# Altium project Battman.PrjPcb
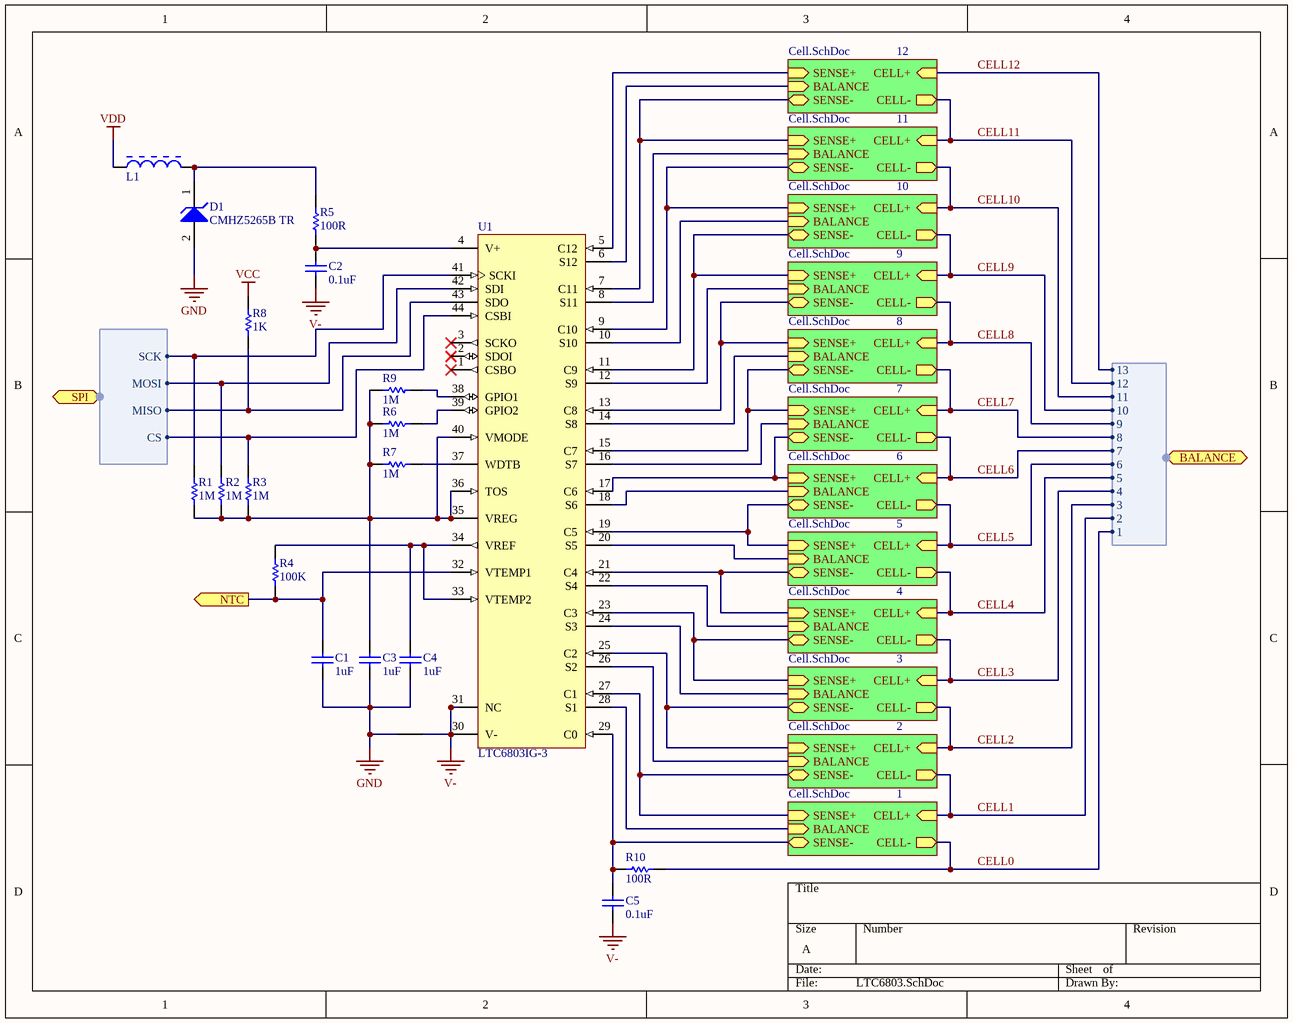
[diagram p0: LTC6803.SchDoc]
6 sheets, 131 parts. Net scope: hierarchical (ports join the sheet entries above them; power ports are global).
Board file: BMS.PcbDoc
Sheets:
  LTC6803.SchDoc
  MCU.SchDoc
  Charging.SchDoc
  3V3.SchDoc
  Switches.SchDoc
  Buzzer.SchDoc

## Sheet LTC6803.SchDoc
size A; SheetNumber: 4

### Parts
*  NetTie  [NetTie]  (value not drawn)  (net tie, no BOM)
C1  value 1uF  [C0402[1005X55]]  (hidden comment: 1uF 6.3V 0402)
C2  value 0.1uF  [C0402[1005X55]]  (hidden comment: 0.1uF 100V 0402)
C3  value 1uF  [C0402[1005X55]]  (hidden comment: 1uF 6.3V 0402)
C4  value 1uF  [C0402[1005X55]]  (hidden comment: 1uF 6.3V 0402)
C5  value 0.1uF  [C0402[1005X55]]  (hidden comment: 0.1uF 6.3V 0402)
D1  CMHZ5265B TR  [SOD-123]
L1  MURA-FB-2  [MURA-BLM31-B60-CHIP-2_V3]  (value not drawn)
R1  value 1M  [R0402[1005]]  (hidden comment: 1M 1% 0402)
R2  value 1M  [R0402[1005]]  (hidden comment: 1M 1% 0402)
R3  value 1M  [R0402[1005]]  (hidden comment: 1M 1% 0402)
R4  value 100K  [R0402[1005]]  (hidden comment: 100K 1% 0402)
R5  value 100R  [R0402[1005]]  (hidden comment: 100R 1% 0402)
R6  value 1M  [R0402[1005]]  (hidden comment: 1M 1% 0402)
R7  value 1M  [R0402[1005]]  (hidden comment: 1M 1% 0402)
R8  value 1K  [R0402[1005]]  (hidden comment: 1K 1% 0402)
R9  value 1M  [R0402[1005]]  (hidden comment: 1M 1% 0402)
R10  value 100R  [R0402[1005]]  (hidden comment: 100R 1% 0402)
U1  LTC6803IG-3  [TSSOP-44]

### Sub-sheets
1 = Cell.SchDoc (file not in this document): SENSE+, SENSE- (bidir), BALANCE (in), CELL+ (in), CELL- (out)
2 = Cell.SchDoc (file not in this document): SENSE+, SENSE- (bidir), BALANCE (in), CELL+ (in), CELL- (out)
3 = Cell.SchDoc (file not in this document): SENSE+, SENSE- (bidir), BALANCE (in), CELL+ (in), CELL- (out)
4 = Cell.SchDoc (file not in this document): SENSE+, SENSE- (bidir), BALANCE (in), CELL+ (in), CELL- (out)
5 = Cell.SchDoc (file not in this document): SENSE+, SENSE- (bidir), BALANCE (in), CELL+ (in), CELL- (out)
6 = Cell.SchDoc (file not in this document): SENSE+, SENSE- (bidir), BALANCE (in), CELL+ (in), CELL- (out)
7 = Cell.SchDoc (file not in this document): SENSE+, SENSE- (bidir), BALANCE (in), CELL+ (in), CELL- (out)
8 = Cell.SchDoc (file not in this document): SENSE+, SENSE- (bidir), BALANCE (in), CELL+ (in), CELL- (out)
9 = Cell.SchDoc (file not in this document): SENSE+, SENSE- (bidir), BALANCE (in), CELL+ (in), CELL- (out)
10 = Cell.SchDoc (file not in this document): SENSE+, SENSE- (bidir), BALANCE (in), CELL+ (in), CELL- (out)
11 = Cell.SchDoc (file not in this document): SENSE+, SENSE- (bidir), BALANCE (in), CELL+ (in), CELL- (out)
12 = Cell.SchDoc (file not in this document): SENSE+, SENSE- (bidir), BALANCE (in), CELL+ (in), CELL- (out)

### Ports
BALANCE (harness Balance), NTC (out), SPI (harness SPI)

### Harnesses
SPI: SCK, MOSI, MISO, CS
Balance: 13, 12, 11, 10, 9, 8, 6, 7, 5, 3, 4, 2, 1

### Nets
GND: *.1 C1.1 C3.1 C4.1 D1.2(A)
V-: *.2 C2.1 C5.1 U1.30(V-) U1.31(NC)
VCC: R8.2
VDD: L1.1
CELL0: R10.2 ; sheet 1/CELL-, port BALANCE.1
CELL1: sheet 2/CELL-, sheet 1/CELL+, port BALANCE.2
CELL2: sheet 3/CELL-, sheet 2/CELL+, port BALANCE.3
CELL3: sheet 4/CELL-, sheet 3/CELL+, port BALANCE.4
CELL4: sheet 5/CELL-, sheet 4/CELL+, port BALANCE.5
CELL5: sheet 6/CELL-, sheet 5/CELL+, port BALANCE.6
CELL6: sheet 7/CELL-, sheet 6/CELL+, port BALANCE.7
CELL7: sheet 8/CELL-, sheet 7/CELL+, port BALANCE.8
CELL8: sheet 9/CELL-, sheet 8/CELL+, port BALANCE.9
CELL9: sheet 10/CELL-, sheet 9/CELL+, port BALANCE.10
CELL10: sheet 11/CELL-, sheet 10/CELL+, port BALANCE.11
CELL11: sheet 12/CELL-, sheet 11/CELL+, port BALANCE.12
CELL12: sheet 12/CELL+, port BALANCE.13
NetC1_2: C1.2 R4.1 U1.32(VTEMP1) ; port NTC
NetC2_2: C2.2 R5.1 U1.4(V+)
NetC3_2: C3.2 R1.1 R2.1 R3.1 R6.2 R7.2 R9.2 U1.35(VREG) U1.36(TOS) U1.40(VMODE)
NetC4_2: C4.2 R4.2 U1.33(VTEMP2) U1.34(VREF)
NetC5_2: C5.2 R10.1 U1.29(C0) ; sheet 1/SENSE-
NetD1_1: D1.1(K) L1.2 R5.2
NetR1_2: R1.2 U1.41(SCKI) ; port SPI.SCK
NetR2_2: R2.2 U1.42(SDI) ; port SPI.MOSI
NetR3_2: R3.2 U1.44(CSBI) ; port SPI.CS
NetR6_1: R6.1 U1.39(GPIO2)
NetR7_1: R7.1 U1.37(WDTB)
NetR8_1: R8.1 U1.43(SDO) ; port SPI.MISO
NetR9_1: R9.1 U1.38(GPIO1)
NetU1_5: U1.5(C12) ; sheet 12/SENSE+
NetU1_6: U1.6(S12) ; sheet 12/BALANCE
NetU1_7: U1.7(C11) ; sheet 12/SENSE-, sheet 11/SENSE+
NetU1_8: U1.8(S11) ; sheet 11/BALANCE
NetU1_9: U1.9(C10) ; sheet 11/SENSE-, sheet 10/SENSE+
NetU1_10: U1.10(S10) ; sheet 10/BALANCE
NetU1_11: U1.11(C9) ; sheet 10/SENSE-, sheet 9/SENSE+
NetU1_12: U1.12(S9) ; sheet 9/BALANCE
NetU1_13: U1.13(C8) ; sheet 9/SENSE-, sheet 8/SENSE+
NetU1_14: U1.14(S8) ; sheet 8/BALANCE
NetU1_15: U1.15(C7) ; sheet 8/SENSE-, sheet 7/SENSE+
NetU1_16: U1.16(S7) ; sheet 7/BALANCE
NetU1_17: U1.17(C6) ; sheet 7/SENSE-, sheet 6/SENSE+
NetU1_18: U1.18(S6) ; sheet 6/BALANCE
NetU1_19: U1.19(C5) ; sheet 6/SENSE-, sheet 5/SENSE+
NetU1_20: U1.20(S5) ; sheet 5/BALANCE
NetU1_21: U1.21(C4) ; sheet 5/SENSE-, sheet 4/SENSE+
NetU1_22: U1.22(S4) ; sheet 4/BALANCE
NetU1_23: U1.23(C3) ; sheet 4/SENSE-, sheet 3/SENSE+
NetU1_24: U1.24(S3) ; sheet 3/BALANCE
NetU1_25: U1.25(C2) ; sheet 3/SENSE-, sheet 2/SENSE+
NetU1_26: U1.26(S2) ; sheet 2/BALANCE
NetU1_27: U1.27(C1) ; sheet 2/SENSE-, sheet 1/SENSE+
NetU1_28: U1.28(S1) ; sheet 1/BALANCE

Not connected (* = marked no-connect by the designer): U1 1(CSBO)* 2(SDOI)* 3(SCKO)*

### Library data of the parts
C1 C3 C4 = CAP_1uF_6.3V_0402_10%: 1uF 6.3V 10% 0402 (1005 Metric); PartNumber: GRM155R70J105KA12D; Manufacturer: Murata; Tolerance: 10%; Mounting Technology: Surface Mount; PackageReference: 0402; PackageDescription: 0402 (1005 Metric); Voltage: 6.3V
C2 = CAP_0.1uF_100V_0402_10%: 0.1uF 100V 10% 0402 (1005 Metric); PartNumber: GRM155R62A104KE14D; Manufacturer: Murata; Tolerance: 10%; Mounting Technology: Surface Mount; PackageReference: 0402; PackageDescription: 0402 (1005 Metric); Voltage: 100V
C5 = CAP_0.1uF_6.3V_0402_10%: 0.1uF 6.3V 10% 0402 (1005 Metric); PartNumber: GRM155R70J104KA01D; Manufacturer: Murata; Tolerance: 10%; Mounting Technology: Surface Mount; PackageReference: 0402; PackageDescription: 0402 (1005 Metric); Voltage: 6.3V
D1 = CMHZ5265B: Zener Diodes 500mW Zener Diode 185mA 58.9V to 2V; Manufacturer: Central Semiconductor; PartNumber: CMHZ5265B TR; Mounting Technology: Surface Mount; PackageReference: SOD-123; PackageDescription: SOD, 2-Leads, Body 2.69x1.6mm
L1 = MURA-FB-2: EMI Filter Beads, Chips & Arrays 1206 33 OHM; PartNumber: BLM31PG330SN1L; Manufacturer: Murata; Mounting Technology: Surface Mount; PackageReference: 1206; PackageDescription: 1206 (3216 Metric)
R1-R3 R6 R7 R9 = RES_1M_0402_1%: 1M 0.063W 1% 0402 (1005 Metric); Manufacturer: KOA Speer; PartNumber: RK73H1ETTP1004F; Power: 0.063W; Tolerance: 1%; Mounting Technology: Surface Mount; PackageReference: 0402; PackageDescription: 0402 (1005 Metric); ComponentLink1Description: Datasheet; ComponentLink1URL: http://www.koaspeer.com/catimages/Products/RK73H/RK73H.pdf
R4 = RES_100K_0402_1%: 100K 0.063W 1% 0402 (1005 Metric); Manufacturer: KOA Speer; PartNumber: RK73H1ETTP1003F; Power: 0.063W; Tolerance: 1%; Mounting Technology: Surface Mount; PackageReference: 0402; PackageDescription: 0402 (1005 Metric); ComponentLink1Description: Datasheet; ComponentLink1URL: http://www.koaspeer.com/catimages/Products/RK73H/RK73H.pdf
R5 R10 = RES_100R_0402_1%: 100R 0.063W 1% 0402 (1005 Metric); Manufacturer: KOA Speer; PartNumber: RK73H1ETTP1000F; Power: 0.063W; Tolerance: 1%; Mounting Technology: Surface Mount; PackageReference: 0402; PackageDescription: 0402 (1005 Metric); ComponentLink1Description: Datasheet; ComponentLink1URL: http://www.koaspeer.com/catimages/Products/RK73H/RK73H.pdf
R8 = RES_1K_0402_1%: 1K 0.063W 1% 0402 (1005 Metric); Manufacturer: KOA Speer; PartNumber: RK73H1ETTP1001F; Tolerance: 1%; Power: 0.063W; Mounting Technology: Surface Mount; PackageReference: 0402; PackageDescription: 0402 (1005 Metric); ComponentLink1Description: Datasheet; ComponentLink1URL: http://www.koaspeer.com/catimages/Products/RK73H/RK73H.pdf
U1 = LTC6803IG-3: PartNumber: LTC6803IG-3#PBF; Manufacturer: Linear Technology; PackageReference: TSSOP-44; Mounting Technology: Surface Mount; PackageDescription: SOP, 44-Leads, Body 13.1x5.6mm, Pitch 0.5mm

## Sheet MCU.SchDoc
size A; SheetNumber: 3
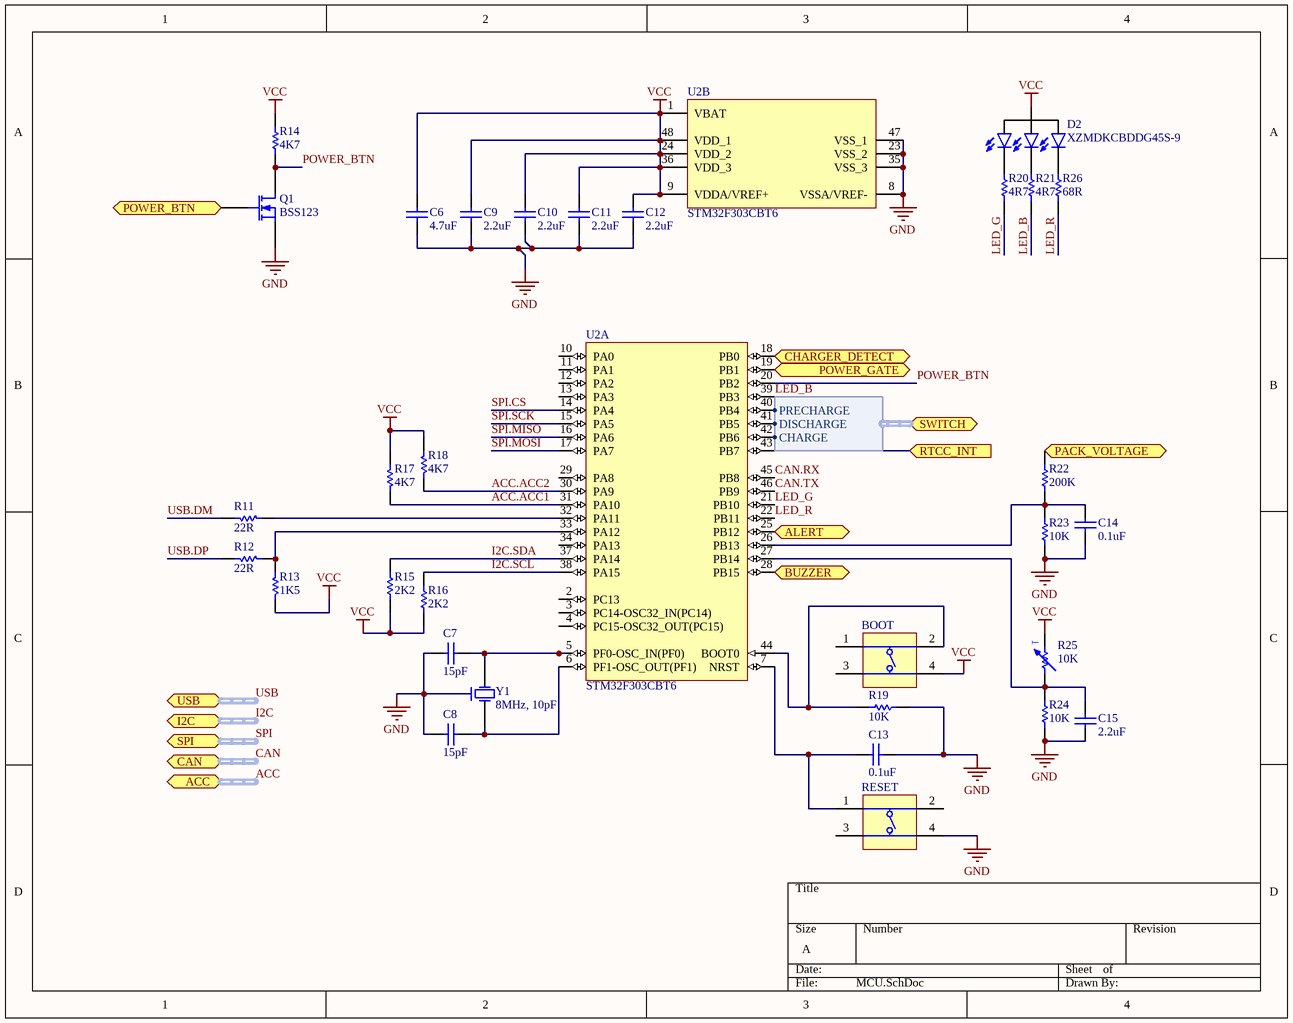
[diagram p1: MCU.SchDoc]

### Parts
BOOT  (no value)  [SWITCH]
C6  value 4.7uF  [C0402[1005X55]]  (hidden comment: 4.7uF 6.3V 0402)
C7  value 15pF  [C0402[1005X55]]  (hidden comment: 15pF 50V 0402)
C8  value 15pF  [C0402[1005X55]]  (hidden comment: 15pF 50V 0402)
C9  value 2.2uF  [C0402[1005X55]]  (hidden comment: 2.2uF 6.3V 0402)
C10  value 2.2uF  [C0402[1005X55]]  (hidden comment: 2.2uF 6.3V 0402)
C11  value 2.2uF  [C0402[1005X55]]  (hidden comment: 2.2uF 6.3V 0402)
C12  value 2.2uF  [C0402[1005X55]]  (hidden comment: 2.2uF 6.3V 0402)
C13  value 0.1uF  [C0402[1005X55]]  (hidden comment: 0.1uF 6.3V 0402)
C14  value 0.1uF  [C0402[1005X55]]  (hidden comment: 0.1uF 6.3V 0402)
C15  value 2.2uF  [C0402[1005X55]]  (hidden comment: 2.2uF 6.3V 0402)
D2  XZMDKCBDDG45S-9  [XZMDKCBDDG45S-9]
Q1  BSS123  [SOT323-3]
R11  value 22R  [R0402[1005]]  (hidden comment: 22R 1% 0402)
R12  value 22R  [R0402[1005]]  (hidden comment: 22R 1% 0402)
R13  value 1K5  [R0402[1005]]  (hidden comment: 1K5 1% 0402)
R14  value 4K7  [R0402[1005]]  (hidden comment: 4K7 1% 0402)
R15  value 2K2  [R0402[1005]]  (hidden comment: 2K2 1% 0402)
R16  value 2K2  [R0402[1005]]  (hidden comment: 2K2 1% 0402)
R17  value 4K7  [R0402[1005]]  (hidden comment: 4K7 1% 0402)
R18  value 4K7  [R0402[1005]]  (hidden comment: 4K7 1% 0402)
R19  value 10K  [R0402[1005]]  (hidden comment: 10K 1% 0402)
R20  value 4R7  [R0402[1005]]  (hidden comment: 4R7 1% 0402)
R21  value 4R7  [R0402[1005]]  (hidden comment: 4R7 1% 0402)
R22  value 200K  [R0402[1005]]  (hidden comment: 200K 1% 0402)
R23  value 10K  [R0402[1005]]  (hidden comment: 10K 1% 0402)
R24  value 10K  [R0402[1005]]  (hidden comment: 10K 1% 0402)
R25  value 10K  [R0402[1005]]  (hidden comment: 10K 0.5% 0402)
R26  value 68R  [R0402[1005]]  (hidden comment: 68R 1% 0402)
RESET  (no value)  [SWITCH]
U2  STM32F303CBT6  [LQFP-48]  (parts A,B of 2)
Y1  8MHz, 10pF  [ABRA-ABM3B-4_V]

### Ports
ACC (harness Accessory Outputs), ALERT (in), BUZZER (out), CAN (harness CAN Input), CHARGER_DETECT (in), I2C (harness I2C), PACK_VOLTAGE (in), POWER_BTN (in), POWER_GATE (out), RTCC_INT (in), SPI (harness SPI), SWITCH (harness Switches), USB (harness USB)

### Harnesses
Switches: CHARGE, DISCHARGE, PRECHARGE

### Nets
GND: C6.1 C7.1 C8.1 C9.1 C10.1 C11.1 C12.1 C13.2 C14.1 C15.1 Q1.2(S) R19.2 R23.1 R24.1 RESET.4(T3) U2.8(VSSA/VREF-) U2.23(VSS_2) U2.35(VSS_3) U2.47(VSS_1) Y1.2
VCC: BOOT.4(T3) C6.2 C9.2 C10.2 C11.2 C12.2 D2.2(A) R13.1 R14.2 R15.2 R16.2 R17.2 R18.2 R25.2 U2.1(VBAT) U2.9(VDDA/VREF+) U2.24(VDD_2) U2.36(VDD_3) U2.48(VDD_1)
ACC.ACC1: R17.1 U2.31(PA10)
ACC.ACC2: R18.1 U2.30(PA9)
CAN.RX: U2.45(PB8)
CAN.TX: U2.46(PB9)
I2C.SCL: R16.1 U2.38(PA15)
I2C.SDA: R15.1 U2.37(PA14)
LED_B: R21.1 U2.39(PB3)
LED_G: R20.1 U2.21(PB10)
LED_R: R26.1 U2.22(PB11)
POWER_BTN: Q1.3(D) R14.1 U2.20(PB2)
SPI.CS: U2.14(PA4)
SPI.MISO: U2.16(PA6)
SPI.MOSI: U2.17(PA7)
SPI.SCK: U2.15(PA5)
USB.DM: R11.2
USB.DP: R12.2
NetBOOT_2: BOOT.2(T2) R19.1 U2.44(BOOT0)
NetC7_2: C7.2 U2.5(PF0-OSC_IN(PF0)) Y1.1(X1)
NetC8_2: C8.2 U2.6(PF1-OSC_OUT(PF1)) Y1.3(X2)
NetC13_1: C13.1 RESET.1(T1) U2.7(NRST)
NetC14_2: C14.2 R22.2 R23.2 U2.26(PB13)
NetC15_2: C15.2 R24.2 R25.1 U2.27(PB14)
NetD2_1: D2.1(K_Red) R26.2
NetD2_3: D2.3(K_Blue) R21.2
NetD2_4: D2.4(K_Green) R20.2
NetQ1_1: Q1.1(G) ; port POWER_BTN
NetR11_1: R11.1 U2.32(PA11)
NetR12_1: R12.1 R13.2 U2.33(PA12)
NetR22_1: R22.1 ; port PACK_VOLTAGE
NetU2_18: U2.18(PB0) ; port CHARGER_DETECT
NetU2_19: U2.19(PB1) ; port POWER_GATE
NetU2_25: U2.25(PB12) ; port ALERT
NetU2_28: U2.28(PB15) ; port BUZZER
NetU2_40: U2.40(PB4) ; port SWITCH.PRECHARGE
NetU2_41: U2.41(PB5) ; port SWITCH.DISCHARGE
NetU2_42: U2.42(PB6) ; port SWITCH.CHARGE
NetU2_43: U2.43(PB7) ; port RTCC_INT

Not connected (* = marked no-connect by the designer): BOOT 1(T1) 3(T3); RESET 2(T2) 3(T3); U2 2(PC13) 3(PC14-OSC32_IN(PC14)) 4(PC15-OSC32_OUT(PC15)) 10(PA0) 11(PA1) 12(PA2) 13(PA3) 29(PA8) 34(PA13)

### Buses and harness runs
harness ACC = port ACC
harness CAN = port CAN
harness I2C = port I2C
harness SPI = port SPI
harness USB = port USB

### Notes on the sheet
- (in symbol NTC_10K_0402_0.5%) T

### Library data of the parts
BOOT RESET = DIPT-DTSM-6: Switch, SPNO Push Button SMD; Manufacturer: C&K Components; PartNumber: PTS810 SJM 250 SMTR LFS; Packing Type: Tape&Reel; Mechanical Life: 200,000 cycles; ComponentLink2URL: http://www.dip.com.tw/Products_tact.htm; ComponentLink1URL: http://www.dip.com.tw/; ComponentLink3URL: http://www.dip.com.tw/PDF/pro_tact/DTSM_G_-6_2_-V.pdf; PackageDescription: Switch, Surface Mount, 4 Leads, Body 4.6x2.8mm, Height 1.9mm; ComponentLink2Description: Datasheet; ComponentLink3Description: Package Specification; ComponentLink1Description: Manufacturer URL; PackageReference: PTS810; Mounting Technology: Surface Mount
C6 = CAP_4.7uF_6.3V_0402_20%: 4.7uF 6.3V 20% 0402 (1005 Metric); PartNumber: GRM155R60J475ME47D; Manufacturer: Murata; Tolerance: 20%; Mounting Technology: Surface Mount; PackageReference: 0402; PackageDescription: 0402 (1005 Metric); Voltage: 6.3V
C7 C8 = CAP_15pF_50V_0402_5%: 15pF 50V 5% 0402 (1005 Metric); PartNumber: GRM1555C1H150JA01D; Manufacturer: Murata; Tolerance: 5%; Mounting Technology: Surface Mount; PackageReference: 0402; PackageDescription: 0402 (1005 Metric); Voltage: 50V
C9-C12 C15 = CAP_2.2uF_6.3V_0402_20%: 2.2uF 6.3V 20% 0402 (1005 Metric); PartNumber: GRM155R60J225ME15D; Manufacturer: Murata; Tolerance: 20%; Mounting Technology: Surface Mount; PackageReference: 0402; PackageDescription: 0402 (1005 Metric); Voltage: 6.3V
C13 C14 = CAP_0.1uF_6.3V_0402_10%: as C5 on sheet LTC6803; Tolerance: 10%; Mounting Technology: Surface Mount; PackageReference: 0402; PackageDescription: 0402 (1005 Metric); Voltage: 6.3V
D2 = XZMDKCBDDG45S-9: Manufacturer: SunLED; PartNumber: XZMDKCBDDG45S-9; PackageReference: 4-PLCC; Mounting Technology: Surface Mount; PackageDescription: 4-SMD, Gull Wing,  3.20mm L x 2.80mm W
Q1 = BSS123WQ-7-F: N-Channel MOSFET; Manufacturer: Diodes Incorporated; PackageReference: SOT-323-3; PartNumber: BSS123WQ-7-F; Mounting Technology: Surface Mount
R11 R12 = RES_22R_0402_1%: 22R 0.063W 1% 0402 (1005 Metric); Manufacturer: KOA Speer; PartNumber: RK73H1ETTP22R0F; Power: 0.063W; Tolerance: 1%; Mounting Technology: Surface Mount; PackageReference: 0402; PackageDescription: 0402 (1005 Metric); ComponentLink1Description: Datasheet; ComponentLink1URL: http://www.koaspeer.com/catimages/Products/RK73H/RK73H.pdf
R13 = RES_1K5_0402_1%: 1K5 0.063W 1% 0402 (1005 Metric); Manufacturer: KOA Speer; PartNumber: RK73H1ETTP1501F; Tolerance: 1%; Power: 0.063W; Mounting Technology: Surface Mount; PackageReference: 0402; PackageDescription: 0402 (1005 Metric); ComponentLink1Description: Datasheet; ComponentLink1URL: http://www.koaspeer.com/catimages/Products/RK73H/RK73H.pdf
R14 R17 R18 = RES_4K7_0402_1%: 4K7 0.063W 1% 0402 (1005 Metric); Manufacturer: KOA Speer; PartNumber: RK73H1ETTP4701F; Tolerance: 1%; Power: 0.063W; Mounting Technology: Surface Mount; PackageReference: 0402; PackageDescription: 0402 (1005 Metric); ComponentLink1Description: Datasheet; ComponentLink1URL: http://www.koaspeer.com/catimages/Products/RK73H/RK73H.pdf
R15 R16 = RES_2K2_0402_1%: 2K2 0.063W 1% 0402 (1005 Metric); Manufacturer: KOA Speer; PartNumber: RK73H1ETTP2201F; Tolerance: 1%; Power: 0.063W; Mounting Technology: Surface Mount; PackageReference: 0402; PackageDescription: 0402 (1005 Metric); ComponentLink1Description: Datasheet; ComponentLink1URL: http://www.koaspeer.com/catimages/Products/RK73H/RK73H.pdf
R19 R23 R24 = RES_10K_0402_1%: 10K 0.063W 1% 0402 (1005 Metric); Manufacturer: KOA Speer; PartNumber: RK73H1ETTP1002F; Tolerance: 1%; Power: 0.063W; Mounting Technology: Surface Mount; PackageReference: 0402; PackageDescription: 0402 (1005 Metric); ComponentLink1Description: Datasheet; ComponentLink1URL: http://www.koaspeer.com/catimages/Products/RK73H/RK73H.pdf
R20 R21 = RES_4R7_0402_1%: 4R7 0.063W 1% 0402 (1005 Metric); Manufacturer: KOA Speer; PartNumber: RK73H1ETTP4R70F; Power: 0.063W; Tolerance: 1%; Mounting Technology: Surface Mount; PackageReference: 0402; PackageDescription: 0402 (1005 Metric); ComponentLink1Description: Datasheet; ComponentLink1URL: http://www.koaspeer.com/catimages/Products/RK73H/RK73H.pdf
R22 = RES_200K_0402_1%: 200K 0.063W 1% 0402 (1005 Metric); Manufacturer: KOA Speer; PartNumber: RK73H1ETTP2003F; Tolerance: 1%; Power: 0.063W; Mounting Technology: Surface Mount; PackageReference: 0402; PackageDescription: 0402 (1005 Metric); ComponentLink1Description: Datasheet; ComponentLink1URL: http://www.koaspeer.com/catimages/Products/RK73H/RK73H.pdf
R25 = NTC_10K_0402_0.5%: NTC 10K 0.5% 0402 (1005 Metric); PartNumber: NCP15XH103D03RC; Manufacturer: Murata; Power: 0.1W; Tolerance: 0.5%; Mounting Technology: Surface Mount; PackageReference: 0402; PackageDescription: 0402 (1005 Metric)
R26 = RES_68R_0402_1%: 68R 0.063W 1% 0402 (1005 Metric); Manufacturer: KOA Speer; PartNumber: RK73H1ETTP68R0F; Tolerance: 1%; Power: 0.063W; Mounting Technology: Surface Mount; PackageReference: 0402; PackageDescription: 0402 (1005 Metric); ComponentLink1Description: Datasheet; ComponentLink1URL: http://www.koaspeer.com/catimages/Products/RK73H/RK73H.pdf
U2 = STM32F303CBT6: Manufacturer: STMicroelectronics; PackageReference: LQFP-48; Mounting Technology: Surface Mount; PartNumber: STM32F303CBT6; PackageDescription: QFP, 48-Leads, Body 7x7mm, Pitch 0.5mm
Y1 = ABRA-ABM3B-4: PartNumber: ABM3B-8.000MHZ-10-1UT; Manufacturer: ABRACON; Mounting Technology: Surface Mount; PackageReference: 2012; PackageDescription: 2012 (5032 metric)

## Sheet Charging.SchDoc
size A; SheetNumber: 6
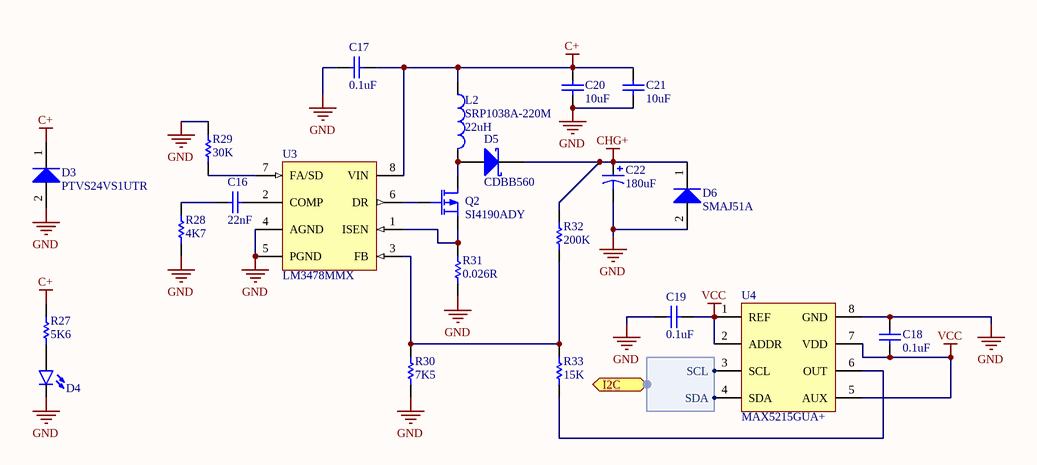
[diagram p2: Charging.SchDoc]

### Parts
C16  value 22nF  [C0402[1005X55]]  (hidden comment: 22nF 50V 0402)
C17  value 0.1uF  [C0402[1005X55]]  (hidden comment: 0.1uF 100V 0402)
C18  value 0.1uF  [C0402[1005X55]]  (hidden comment: 0.1uF 6.3V 0402)
C19  value 0.1uF  [C0402[1005X55]]  (hidden comment: 0.1uF 6.3V 0402)
C20  value 10uF  [C1206[3216X160]]  (hidden comment: 10uF 50V 1206)
C21  value 10uF  [C1206[3216X160]]  (hidden comment: 10uF 50V 1206)
C22  value 180uF  [CAP-ELECTROLYTIC[10.0x12.6]]  (hidden comment: 180uF 50V)
D3  PTVS24VS1UTR  [SOD-123W]
D4  LED_0603_GREEN_5mA  [LED0603]  (value not drawn)
D5  CDBB560  [DO-214AA]
D6  SMAJ51A  [DO-214AC]
L2  SRP1038A-220M  value 22uH  [SRP1038A]
Q2  SI4190ADY  [SO-8]
R27  value 5K6  [R0402[1005]]  (hidden comment: 5K6 1% 0402)
R28  value 4K7  [R0402[1005]]  (hidden comment: 4K7 1% 0402)
R29  value 30K  [R0402[1005]]  (hidden comment: 30K 1% 0402)
R30  value 7K5  [R0402[1005]]  (hidden comment: 7K5 1% 0402)
R31  value 0.026R  [R1206[3216]]  (hidden comment: 0.026R 1% 1206)
R32  value 200K  [R0402[1005]]  (hidden comment: 200K 1% 0402)
R33  value 15K  [R0402[1005]]  (hidden comment: 15K 1% 0402)
U3  LM3478MMX  [MSOP-8]
U4  MAX5215GUA+  [MSOP-8]

### Ports
I2C (harness I2C)

### Harnesses
I2C: SCL, SDA

### Nets
C+: C17.2 C20.2 C21.2 D3.1(K) L2.1 R27.2 U3.8(VIN)
CHG+: C22.1 D5.2(K) D6.1(K) R32.2
GND: C17.1 C18.1 C19.1 C20.1 C21.1 C22.2 D3.2(A) D4.C D6.2(A) R28.1 R29.2 R30.1 R31.1 U3.4(AGND) U3.5(PGND) U4.8(GND)
VCC: C18.2 C19.2 U4.1(REF) U4.2(ADDR) U4.5(AUX) U4.7(VDD)
NetC16_1: C16.1 R28.2
NetC16_2: C16.2 U3.2(COMP)
NetD4_A: D4.A R27.1
NetD5_1: D5.1(A) L2.2 Q2.3(D)
NetQ2_1: Q2.1(S) R31.2 U3.1(ISEN)
NetQ2_2: Q2.2(G) U3.6(DR)
NetR29_1: R29.1 U3.7(FA/SD)
NetR30_2: R30.2 R32.1 R33.2 U3.3(FB)
NetR33_1: R33.1 U4.6(OUT)
NetU4_3: U4.3(SCL) ; port I2C.SCL
NetU4_4: U4.4(SDA) ; port I2C.SDA

### Library data of the parts
C16 = CAP_22nF_50V_0402_10%: 22nF 50V 10% 0402 (1005 Metric); PartNumber: GRM155R71H223KA12J; Manufacturer: Murata; Tolerance: 10%; Mounting Technology: Surface Mount; PackageReference: 0402; PackageDescription: 0402 (1005 Metric); Voltage: 50V
C17 = CAP_0.1uF_100V_0402_10%: as C2 on sheet LTC6803; Mounting Technology: Surface Mount; PackageReference: 0402; PackageDescription: 0402 (1005 Metric); Voltage: 100V; Tolerance: 10%
C18 C19 = CAP_0.1uF_6.3V_0402_10%: as C5 on sheet LTC6803; Mounting Technology: Surface Mount; PackageReference: 0402; PackageDescription: 0402 (1005 Metric); Voltage: 6.3V; Tolerance: 10%
C20 C21 = CAP_10uF_50V_1206_20%: 10uF 50V 20% 1206 (3216 Metric); PartNumber: UMK316BBJ106ML-T; Manufacturer: Taiyo Yuden; Tolerance: 20%; Mounting Technology: Surface Mount; PackageReference: 1206; PackageDescription: 1206 (3216 Metric); Voltage: 50V
C22 = CAP_180uF_50V_20%: 180uF 50V 20%; PartNumber: PCR1H181MCL1GS; Manufacturer: Nichicon; PackageReference: 1H; PackageDescription: 10x12.7mm; Mounting Technology: Surface Mount; Voltage: 50V; Tolerance: 20%
D3 = PTVS24VS1UTR,115: Manufacturer: NXP; Mounting Technology: Surface Mount; PartNumber: PTVS24VS1UTR,115; PackageReference: SOD-123W; PackageDescription: SOD123W, 2-Leads
D4 = LED_0603_GREEN_5mA: PartNumber: LTST-C193TGKT-5A; Manufacturer: Lite-On Inc.; PackageReference: 0603; PackageDescription: 0603 (1608 Metric); Mounting Technology: Surface Mount
D5 = CDBB560-HF: Manufacturer: Comchip Technology; PackageReference: DO-214AA; PackageDescription: DO-214-AA/SMB; 2 C-Bend Leads; Body 5.3 x 3.6 mm, inc. leads (LxW); PartNumber: CDBB560-HF; Mounting Technology: Surface Mount
D6 = SMAJ51A-E3/61: Manufacturer: Vishay; PartNumber: SMAJ51A-E3/61; PackageReference: DO-214AC; PackageDescription: DO-214AC, 2 Leads; Mounting Technology: Surface Mount
L2 = SRP1038A-220M: 22uH 20% 7A 1038; Manufacturer: Bourns; PackageReference: SRP1038A; PartNumber: SRP1038A-220M; Mounting Technology: Surface Mount
Q2 = SI4190ADY-T1-GE3: N-Channel MOSFET; Manufacturer: Vishay; PackageReference: SO-8; PartNumber: SI4190ADY-T1-GE3; Mounting Technology: Surface Mount
R27 = RES_5K6_0402_1%: 5K6 0.063W 1% 0402 (1005 Metric); Manufacturer: KOA Speer; PartNumber: RK73H1ETTP5601F; Power: 0.063W; Tolerance: 1%; Mounting Technology: Surface Mount; PackageReference: 0402; PackageDescription: 0402 (1005 Metric); ComponentLink1Description: Datasheet; ComponentLink1URL: http://www.koaspeer.com/catimages/Products/RK73H/RK73H.pdf
R28 = RES_4K7_0402_1%: as R14 on sheet MCU; Tolerance: 1%; Power: 0.063W; Mounting Technology: Surface Mount; PackageReference: 0402; PackageDescription: 0402 (1005 Metric); ComponentLink1Description: Datasheet; ComponentLink1URL: http://www.koaspeer.com/catimages/Products/RK73H/RK73H.pdf
R29 = RES_30K_0402_1%: 30K 0.063W 1% 0402 (1005 Metric); Manufacturer: KOA Speer; PartNumber: RK73H1ETTP3002F; Tolerance: 1%; Power: 0.063W; Mounting Technology: Surface Mount; PackageReference: 0402; PackageDescription: 0402 (1005 Metric); ComponentLink1Description: Datasheet; ComponentLink1URL: http://www.koaspeer.com/catimages/Products/RK73H/RK73H.pdf
R30 = RES_7K5_0402_1%: 7K5 0.063W 1% 0402 (1005 Metric); Manufacturer: KOA Speer; PartNumber: RK73H1ETTP7501F; Power: 0.063W; Tolerance: 1%; Mounting Technology: Surface Mount; PackageReference: 0402; PackageDescription: 0402 (1005 Metric); ComponentLink1Description: Datasheet; ComponentLink1URL: http://www.koaspeer.com/catimages/Products/RK73H/RK73H.pdf
R31 = RES_0.026R_1206_1%: 0.026R 1W 1% 1206 (3216 Metric); Manufacturer: Panasonic; PartNumber: ERJ-8BWFR027V; Power: 1W; Tolerance: 1%; Mounting Technology: Surface Mount; PackageReference: 1206; PackageDescription: 1206 (3216 Metric); ComponentLink1Description: Datasheet; ComponentLink1URL: https://industrial.panasonic.com/cdbs/www-data/pdf/RDA0000/AOA0000C239.pdf
R32 = RES_200K_0402_1%: as R22 on sheet MCU; Power: 0.063W; Tolerance: 1%; Mounting Technology: Surface Mount; PackageReference: 0402; PackageDescription: 0402 (1005 Metric); ComponentLink1Description: Datasheet; ComponentLink1URL: http://www.koaspeer.com/catimages/Products/RK73H/RK73H.pdf
R33 = RES_15K_0402_1%: 15K 0.063W 1% 0402 (1005 Metric); Manufacturer: KOA Speer; PartNumber: RK73H1ETTP1502F; Tolerance: 1%; Power: 0.063W; Mounting Technology: Surface Mount; PackageReference: 0402; PackageDescription: 0402 (1005 Metric); ComponentLink1Description: Datasheet; ComponentLink1URL: http://www.koaspeer.com/catimages/Products/RK73H/RK73H.pdf
U3 = LM3478MMX: High Efficiency Low-Side N-Channel Controller for Switching Regulator, 8-pin MSOP, Pb-Free, 1000 Reel; Manufacturer: Texas Instruments; PartNumber: LM3478MMX/NOPB; PackageReference: MSOP-8; Mounting Technology: Surface Mount
U4 = MAX5215GUA+: 14 Bit Digital to Analog Converter; Manufacturer: Maxim Integrated; PartNumber: MAX5215GUA+; Mounting Technology: Surface Mount; PackageReference: MSOP-8

## Sheet 3V3.SchDoc
size A; SheetNumber: 2
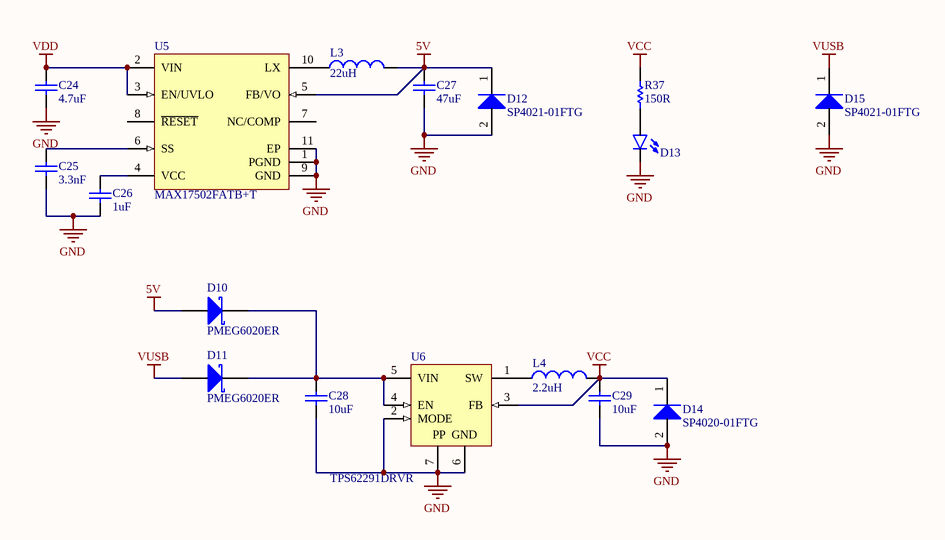
[diagram p3: 3V3.SchDoc]

### Parts
C24  value 4.7uF  [C1210[3225X200]]  (hidden comment: 4.7uF 100V 1210)
C25  value 3.3nF  [C0402[1005X55]]  (hidden comment: 3.3nF 50V 0402)
C26  value 1uF  [C0402[1005X55]]  (hidden comment: 1uF 6.3V 0402)
C27  value 47uF  [C1210[3225X250]]  (hidden comment: 47uF 6.3V 1210)
C28  value 10uF  [C0402[1005X55]]  (hidden comment: 10uF 6.3V 0402)
C29  value 10uF  [C0402[1005X55]]  (hidden comment: 10uF 6.3V 0402)
D10  PMEG6020ER  [SOD-123]
D11  PMEG6020ER  [SOD-123]
D12  SP4021-01FTG  [SOD-323]
D13  LED_0603_GREEN_5mA  [LED0603]  (value not drawn)
D14  SP4020-01FTG  [SOD323]
D15  SP4021-01FTG  [SOD-323]
L3  value 22uH  [SDR0604]
L4  2.2uH  [IND0805]
R37  value 150R  [R0402[1005]]  (hidden comment: 150R 1% 0402)
U5  MAX17502FATB+T  [TDFN-10-EP]
U6  TPS62291DRVR  [WSON-6]

### Nets
5V: C27.2 D10.2(A) D12.1(K) L3.2 U5.5(FB/VO)
GND: C24.1 C25.1 C26.1 C27.1 C28.1 C29.1 D12.2(A) D13.C D14.2(A) D15.2(A) U5.1(PGND) U5.9(GND) U5.11(EP) U6.2(MODE) U6.6(GND) U6.7(EP)
VCC: C29.2 D14.1(K) L4.2 R37.2 U6.3(FB)
VDD: C24.2 U5.2(VIN) U5.3(EN/UVLO)
VUSB: D11.2(A) D15.1(K)
NetC25_2: C25.2 U5.6(SS)
NetC26_2: C26.2 U5.4(VCC)
NetC28_2: C28.2 D10.1(K) D11.1(K) U6.4(EN) U6.5(VIN)
NetD13_A: D13.A R37.1
NetL3_1: L3.1 U5.10(LX)
NetL4_1: L4.1 U6.1(SW)

Not connected (* = marked no-connect by the designer): U5 7(NC/COMP) 8(~{RESET})

### Notes on the sheet
- (in symbol TPS62291DRVR) PP

### Library data of the parts
C24 = CAP_4.7uF_100V_1210_10%: 4.7uF 100V 10% 1210 (3225 Metric); PartNumber: GRJ32DC72A475KE11L; Manufacturer: Murata; Tolerance: 10%; Mounting Technology: Surface Mount; PackageReference: 1210; PackageDescription: 1210 (3225 Metric); Voltage: 100V
C25 = CAP_3.3nF_50V_0402_10%: 3.3nF 50V 10% 0402 (1005 Metric); PartNumber: GRM155R71H332KA01D; Manufacturer: Murata; Tolerance: 10%; Mounting Technology: Surface Mount; PackageReference: 0402; PackageDescription: 0402 (1005 Metric); Voltage: 50V
C26 = CAP_1uF_6.3V_0402_10%: as C1 on sheet LTC6803; Tolerance: 10%; Mounting Technology: Surface Mount; PackageReference: 0402; PackageDescription: 0402 (1005 Metric); Voltage: 6.3V
C27 = CAP_47uF_6.3V_1210_10%: 47uF 6.3V 10% 1210 (3225 Metric); PartNumber: GRM32ER70J476KE20L; Manufacturer: Murata; Tolerance: 10%; Mounting Technology: Surface Mount; PackageReference: 1210; PackageDescription: 1210 (3225 Metric); Voltage: 6.3V
C28 C29 = CAP_10uF_6.3V_0402_20%: 10uF 6.3V 20% 0402 (1005 Metric); PartNumber: GRM155R60J106ME44D; Manufacturer: Murata; Tolerance: 20%; Mounting Technology: Surface Mount; PackageReference: 0402; PackageDescription: 0402 (1005 Metric); Voltage: 6.3V
D10 D11 = PMEG6020ER: PartNumber: PMEG6020ER,115; Manufacturer: NXP Semiconductors; PackageReference: SOD-123W; PackageDescription: SOD, 2-Leads, Body 2.69x1.6mm; Mounting Technology: Surface Mount
D12 D15 = SP4021-01FTG: Manufacturer: Littelfuse; PartNumber: SP4021-01FTG; PackageReference: SOD-323-2; Mounting Technology: Surface Mount
D13 = LED_0603_GREEN_5mA: as D4 on sheet Charging; PackageReference: 0603; PackageDescription: 0603 (1608 Metric); Mounting Technology: Surface Mount
D14 = SP4020-01FTG: Manufacturer: Littelfuse; PartNumber: SP4020-01FTG; PackageReference: SOD-323-2; Mounting Technology: Surface Mount
L3 = SDR0604-220YL: 22uH 30% 1.1A 0604; Manufacturer: Bourns; PartNumber: SDR0604-220YL; PackageReference: SDR0604; Mounting Technology: Surface Mount
L4 = IND_2.2uH_1.7A_0805_20%: 2.2uH 20% 1.7A 0805; PartNumber: LQM21PN2R2MGHL; Manufacturer: Murata; PackageReference: 0805; PackageDescription: 0805 (2012 metric); Value: 2.2uH; Mounting Technology: Surface Mount; Current: 1.7A
R37 = RES_150R_0402_1%: 150R 0.063W 1% 0402 (1005 Metric); Manufacturer: KOA Speer; PartNumber: RK73H1ETTP1500F; Power: 0.063W; Tolerance: 1%; Mounting Technology: Surface Mount; PackageReference: 0402; PackageDescription: 0402 (1005 Metric); ComponentLink1Description: Datasheet; ComponentLink1URL: http://www.koaspeer.com/catimages/Products/RK73H/RK73H.pdf
U5 = MAX17502FATB+T: Ultra-Small, High-Efficiency, Synchronous Step-Down DC-DC Converter, 4.5 to 60 V, 1 A, -40 to 125 degC, 10-Pin TDFN (T1032N+1), RoHS, Tape and Reel; Manufacturer: Maxim Integrated; Mounting Technology: Surface Mount; PartNumber: MAX17502FATB+T; PackageReference: TDFN-10-EP
U6 = TPS62291DRVR: Voltage Regulators - Switching Regulators 2.25MHz 1A Step-Down Cnvrtr 3.3V Output; Manufacturer: Texas Instruments; PartNumber: TPS62291DRVR; PackageReference: WSON-6; PackageDescription: SON, 6-Leads, Body 2x2mm, Pitch 0.65mm, Thermal Pad 1.6x1mm, TI Recommended; Mounting Technology: Surface Mount

## Sheet Switches.SchDoc
size A; SheetNumber: 7
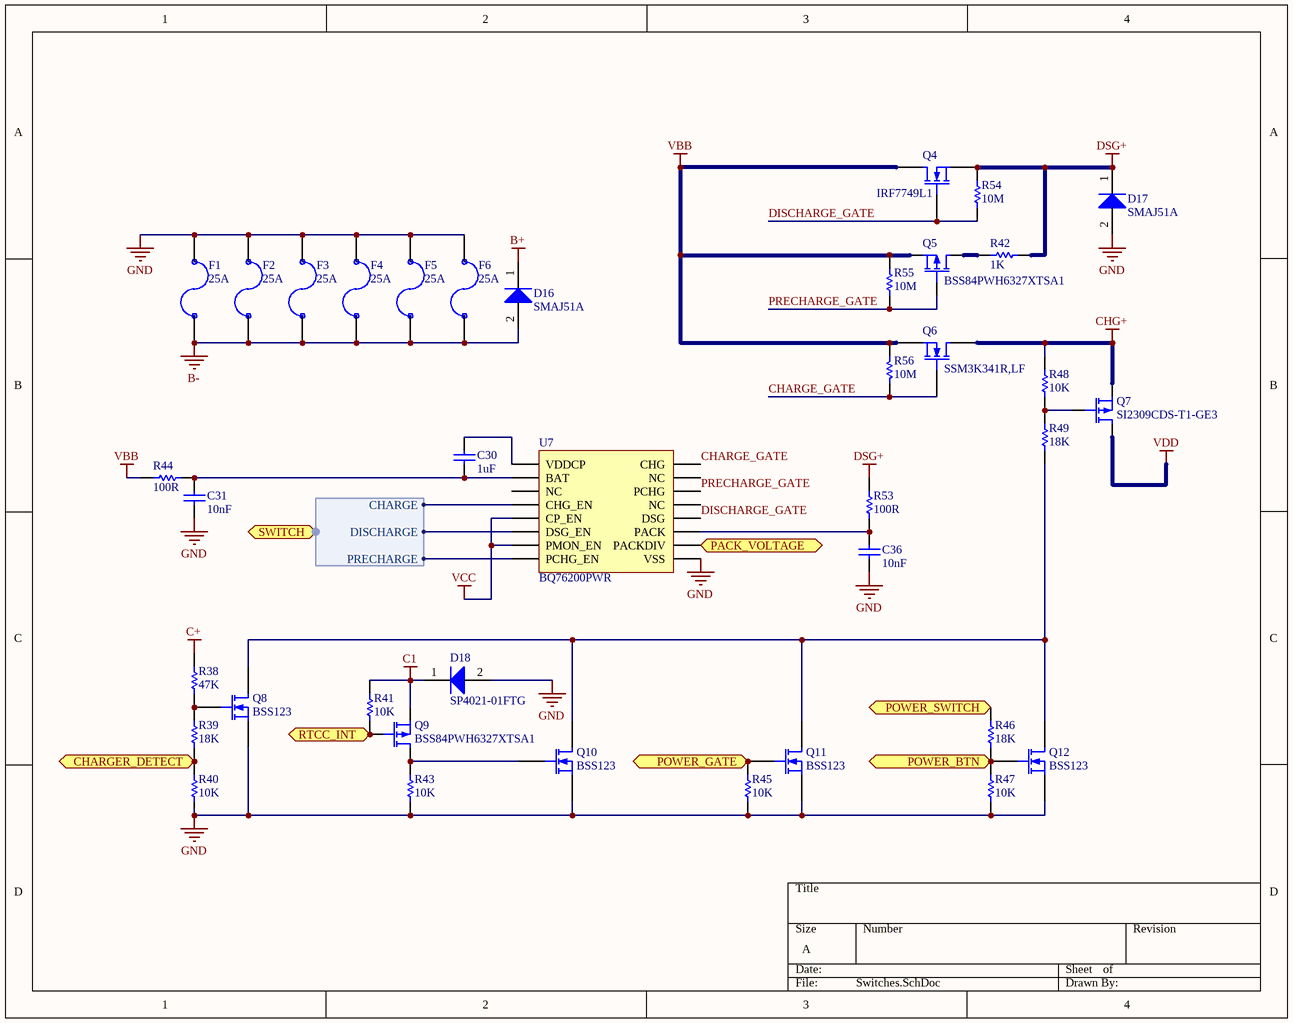
[diagram p4: Switches.SchDoc]

### Parts
C30  value 1uF  [C0603[1608X92]]  (hidden comment: 1uF 50V 0603)
C31  value 10nF  [C0402[1005X55]]  (hidden comment: 10nF 50V 0402)
C36  value 10nF  [C0402[1005X55]]  (hidden comment: 10nF 50V 0402)
D16  SMAJ51A  [DO-214AC]
D17  SMAJ51A  [DO-214AC]
D18  SP4021-01FTG  [SOD-323]
F1  Current: 25A  [1206_FUSE]  (hidden comment: FUSE 1206)
F2  Current: 25A  [1206_FUSE]  (hidden comment: FUSE 1206)
F3  Current: 25A  [1206_FUSE]  (hidden comment: FUSE 1206)
F4  Current: 25A  [1206_FUSE]  (hidden comment: FUSE 1206)
F5  Current: 25A  [1206_FUSE]  (hidden comment: FUSE 1206)
F6  Current: 25A  [1206_FUSE]  (hidden comment: FUSE 1206)
Q4  IRF7749L1  [DIRECTFET-9]
Q5  BSS84PWH6327XTSA1  [SOT323-3]
Q6  SSM3K341R,LF  [SOT23-3]
Q7  SI2309CDS-T1-GE3  [SOT23-3]
Q8  BSS123  [SOT323-3]
Q9  BSS84PWH6327XTSA1  [SOT323-3]
Q10  BSS123  [SOT323-3]
Q11  BSS123  [SOT323-3]
Q12  BSS123  [SOT323-3]
R38  value 47K  [R0402[1005]]  (hidden comment: 47K 1% 0402)
R39  value 18K  [R0402[1005]]  (hidden comment: 18K 1% 0402)
R40  value 10K  [R0402[1005]]  (hidden comment: 10K 1% 0402)
R41  value 10K  [R0402[1005]]  (hidden comment: 10K 1% 0402)
R42  value 1K  [R0805[2012]]  (hidden comment: 1K 1% 0805)
R43  value 10K  [R0402[1005]]  (hidden comment: 10K 1% 0402)
R44  value 100R  [R0402[1005]]  (hidden comment: 100R 1% 0402)
R45  value 10K  [R0402[1005]]  (hidden comment: 10K 1% 0402)
R46  value 18K  [R0402[1005]]  (hidden comment: 18K 1% 0402)
R47  value 10K  [R0402[1005]]  (hidden comment: 10K 1% 0402)
R48  value 10K  [R0402[1005]]  (hidden comment: 10K 1% 0402)
R49  value 18K  [R0402[1005]]  (hidden comment: 18K 1% 0402)
R53  value 100R  [R0402[1005]]  (hidden comment: 100R 1% 0402)
R54  value 10M  [R0402[1005]]  (hidden comment: 10M 1% 0402)
R55  value 10M  [R0402[1005]]  (hidden comment: 10M 1% 0402)
R56  value 10M  [R0402[1005]]  (hidden comment: 10M 1% 0402)
U7  BQ76200PWR  [TSSOP-16]

### Ports
CHARGER_DETECT (out), PACK_VOLTAGE (out), POWER_BTN (out), POWER_GATE (in), POWER_SWITCH (in), RTCC_INT (in), SWITCH (harness Switches)

### Harnesses
Switches: CHARGE, DISCHARGE, PRECHARGE

### Nets
B+: D16.1(K)
B-: D16.2(A) F1.2 F2.2 F3.2 F4.2 F5.2 F6.2
C1: D18.1(K) Q9.2(S) R41.2
C+: R38.2
CHG+: Q6.3(D) Q7.3(S) R48.2
DSG+: D17.1(K) Q4.2(S) R42.1 R53.2 R54.2
GND: C31.1 C36.1 D17.2(A) D18.2(A) F1.1 F2.1 F3.1 F4.1 F5.1 F6.1 Q8.2(S) Q10.2(S) Q11.2(S) Q12.2(S) R40.1 R43.1 R45.1 R47.1 U7.9(VSS)
VBB: Q4.3(D) Q5.2(S) Q6.2(S) R44.1 R55.2 R56.2
VCC: U7.5(CP_EN) U7.7(PMON_EN)
VDD: Q7.2(D)
CHARGE_GATE: Q6.1(G) R56.1 U7.16(CHG)
DISCHARGE_GATE: Q4.1(G) R54.1 U7.12(DSG)
PRECHARGE_GATE: Q5.1(G) R55.1 U7.14(PCHG)
NetC30_1: C30.1 C31.2 R44.2 U7.2(BAT)
NetC30_2: C30.2 U7.1(VDDCP)
NetC36_2: C36.2 R53.1 U7.11(PACK)
NetQ5_3: Q5.3(D) R42.2
NetQ7_1: Q7.1(G) R48.1 R49.2
NetQ8_1: Q8.1(G) R38.1 R39.2
NetQ8_3: Q8.3(D) Q10.3(D) Q11.3(D) Q12.3(D) R49.1
NetQ9_1: Q9.1(G) R41.1 ; port RTCC_INT
NetQ9_3: Q9.3(D) Q10.1(G) R43.2
NetQ11_1: Q11.1(G) R45.2 ; port POWER_GATE
NetQ12_1: Q12.1(G) R46.1 R47.2 ; port POWER_BTN
NetR39_1: R39.1 R40.2 ; port CHARGER_DETECT
NetR46_2: R46.2 ; port POWER_SWITCH
NetU7_4: U7.4(CHG_EN) ; port SWITCH.CHARGE
NetU7_6: U7.6(DSG_EN) ; port SWITCH.DISCHARGE
NetU7_8: U7.8(PCHG_EN) ; port SWITCH.PRECHARGE
NetU7_10: U7.10(PACKDIV) ; port PACK_VOLTAGE

Not connected (* = marked no-connect by the designer): U7 3(NC) 13(NC) 15(NC)

### Library data of the parts
C30 = CAP_1uF_50V_0603_10%: 1uF 50V 10% 0603 (1608 Metric); PartNumber: GRM188R61H105KAALD; Manufacturer: Murata; Tolerance: 10%; Mounting Technology: Surface Mount; PackageReference: 0603; PackageDescription: 0603 (1608 Metric); Voltage: 50V
C31 C36 = CAP_10nF_50V_0402_10%: 10nF 50V 10% 0402 (1005 Metric); PartNumber: GCM155R71H103KA55D; Manufacturer: Murata; Tolerance: 10%; Mounting Technology: Surface Mount; PackageReference: 0402; PackageDescription: 0402 (1005 Metric); Voltage: 50V
D16 D17 = SMAJ51A-E3/61: Manufacturer: Vishay; PartNumber: SMAJ51A-E3/61; PackageReference: DO-214AC; Mounting Technology: Surface Mount; PackageDescription: DO-214AC, 2 Leads
D18 = SP4021-01FTG: Manufacturer: Littelfuse; PartNumber: SP4021-01FTG; PackageReference: SOD-323-2; Mounting Technology: Surface Mount
F1-F6 = FUSE 1206: Surface Mount Fuses UST 1206 FUSE 25A F; PartNumber: 3413.0332.22; Manufacturer: Schurter; Mounting Technology: Surface Mount; PackageReference: 1206; PackageDescription: 1206 (3216 Metric)
Q4 = IRF7749L2: N-Channel MOSFET; PartNumber: IRF7749L1TRPBF; Manufacturer: Infineon Technologies; PackageReference: DIRECTFET L8; PackageDescription: DirectFET™ Isometric L8; Mounting Technology: Surface Mount
Q5 Q9 = BSS84PW H6327: P-Channel MOSFET; Manufacturer: Infineon; PackageReference: SOT323-3; Mounting Technology: Surface Mount; PartNumber: BSS84PWH6327XTSA1
Q6 = SSM3K341R,LF: N-Channel MOSFET; pin to pad: 2>3 3>2; Manufacturer: Toshiba; PackageReference: SOT-23-3; PartNumber: SSM3K341R,LF; Mounting Technology: Surface Mount
Q7 = SI2309CDS-T1-GE3: P-Channel MOSFET; Manufacturer: Vishay; PackageReference: SOT23-3; Mounting Technology: Surface Mount; PartNumber: SI2309CDS-T1-GE3
Q8 Q10-Q12 = BSS123WQ-7-F: as Q1 on sheet MCU; PackageReference: SOT-323-3; PartNumber: BSS123WQ-7-F; Mounting Technology: Surface Mount
R38 = RES_47K_0402_1%: 47K 0.063W 1% 0402 (1005 Metric); Manufacturer: KOA Speer; PartNumber: RK73H1ETTP4702F; Power: 0.063W; Tolerance: 1%; Mounting Technology: Surface Mount; PackageReference: 0402; PackageDescription: 0402 (1005 Metric); ComponentLink1Description: Datasheet; ComponentLink1URL: http://www.koaspeer.com/catimages/Products/RK73H/RK73H.pdf
R39 R46 R49 = RES_18K_0402_1%: 18K 0.063W 1% 0402 (1005 Metric); Manufacturer: KOA Speer; PartNumber: RK73H1ETTP1802F; Tolerance: 1%; Power: 0.063W; Mounting Technology: Surface Mount; PackageReference: 0402; PackageDescription: 0402 (1005 Metric); ComponentLink1Description: Datasheet; ComponentLink1URL: http://www.koaspeer.com/catimages/Products/RK73H/RK73H.pdf
R40 R41 R43 R45 R47 R48 = RES_10K_0402_1%: as R19 on sheet MCU; Tolerance: 1%; Power: 0.063W; Mounting Technology: Surface Mount; PackageReference: 0402; PackageDescription: 0402 (1005 Metric); ComponentLink1Description: Datasheet; ComponentLink1URL: http://www.koaspeer.com/catimages/Products/RK73H/RK73H.pdf
R42 = RES_1K_0805_1%: 1K 0.5W 1% 0805 (2012 Metric); Manufacturer: Panasonic; PartNumber: ERJ-P06F1001V; Tolerance: 1%; Power: 0.5W; Mounting Technology: Surface Mount; PackageReference: 0805; PackageDescription: 0805 (2012 Metric); ComponentLink1Description: Datasheet; ComponentLink1URL: https://industrial.panasonic.com/cdbs/www-data/pdf/RDA0000/AOA0000C243.pdf
R44 R53 = RES_100R_0402_1%: as R5 on sheet LTC6803; Power: 0.063W; Tolerance: 1%; Mounting Technology: Surface Mount; PackageReference: 0402; PackageDescription: 0402 (1005 Metric); ComponentLink1Description: Datasheet; ComponentLink1URL: http://www.koaspeer.com/catimages/Products/RK73H/RK73H.pdf
R54-R56 = RES_10M_0402_1%: 10M 0.063W 1% 0402 (1005 Metric); Manufacturer: KOA Speer; PartNumber: RK73H1ETTP1005F; Tolerance: 1%; Power: 0.063W; Mounting Technology: Surface Mount; PackageReference: 0402; PackageDescription: 0402 (1005 Metric); ComponentLink1Description: Datasheet; ComponentLink1URL: http://www.koaspeer.com/catimages/Products/RK73H/RK73H.pdf
U7 = BQ76200PWR: Battery Management Fast high side NCH drive; Manufacturer: Texas Instruments; PartNumber: BQ76200PWR; PackageReference: TSSOP-16; Mounting Technology: Surface Mount

## Sheet Buzzer.SchDoc
size A; SheetNumber: 11
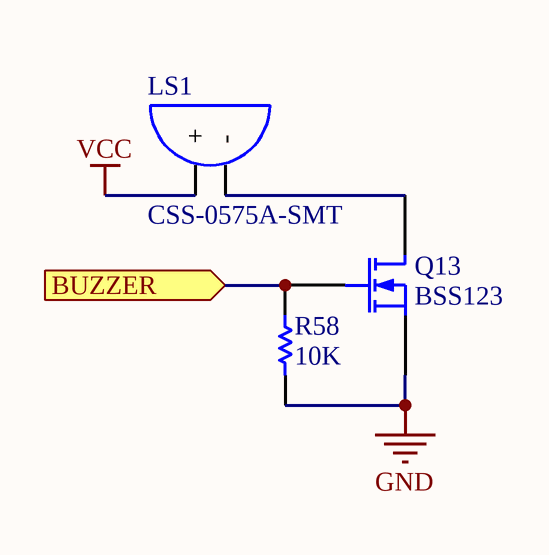
[diagram p5: Buzzer.SchDoc]

### Parts
LS1  CSS-0575A-SMT  [CSS-0575A-SMT]
Q13  BSS123  [SOT323-3]
R58  value 10K  [R0402[1005]]  (hidden comment: 10K 1% 0402)

### Ports
BUZZER (in)

### Nets
GND: Q13.2(S) R58.1
VCC: LS1.1(+)
NetLS1_2: LS1.2(-) Q13.3(D)
NetQ13_1: Q13.1(G) R58.2 ; port BUZZER

### Library data of the parts
LS1 = CSS-0575A-SMT: Magnetic Buzzer Transducer; Manufacturer: CUI, Inc.; PartNumber: CSS-0575A-SMT; Mounting Technology: Surface Mount; PackageReference: 5x5x1.9mm
Q13 = BSS123WQ-7-F: as Q1 on sheet MCU; PackageReference: SOT-323-3; PartNumber: BSS123WQ-7-F; Mounting Technology: Surface Mount
R58 = RES_10K_0402_1%: as R19 on sheet MCU; Tolerance: 1%; Power: 0.063W; Mounting Technology: Surface Mount; PackageReference: 0402; PackageDescription: 0402 (1005 Metric); ComponentLink1Description: Datasheet; ComponentLink1URL: http://www.koaspeer.com/catimages/Products/RK73H/RK73H.pdf

## Nets that join several sheets
C+: Charging (7 pins), Switches (R38.2)
CHG+: Charging (C22.1 D5.2 D6.1 R32.2), Switches (Q6.3 Q7.3 R48.2)
GND: LTC6803 (5 pins), MCU (20 pins), Charging (16 pins), 3V3 (16 pins), Switches (19 pins), Buzzer (Q13.2 R58.1)
VCC: LTC6803 (R8.2), MCU (19 pins), Charging (6 pins), 3V3 (5 pins), Switches (U7.5 U7.7), Buzzer (LS1.1)
VDD: LTC6803 (L1.1), 3V3 (C24.2 U5.2 U5.3), Switches (Q7.2)